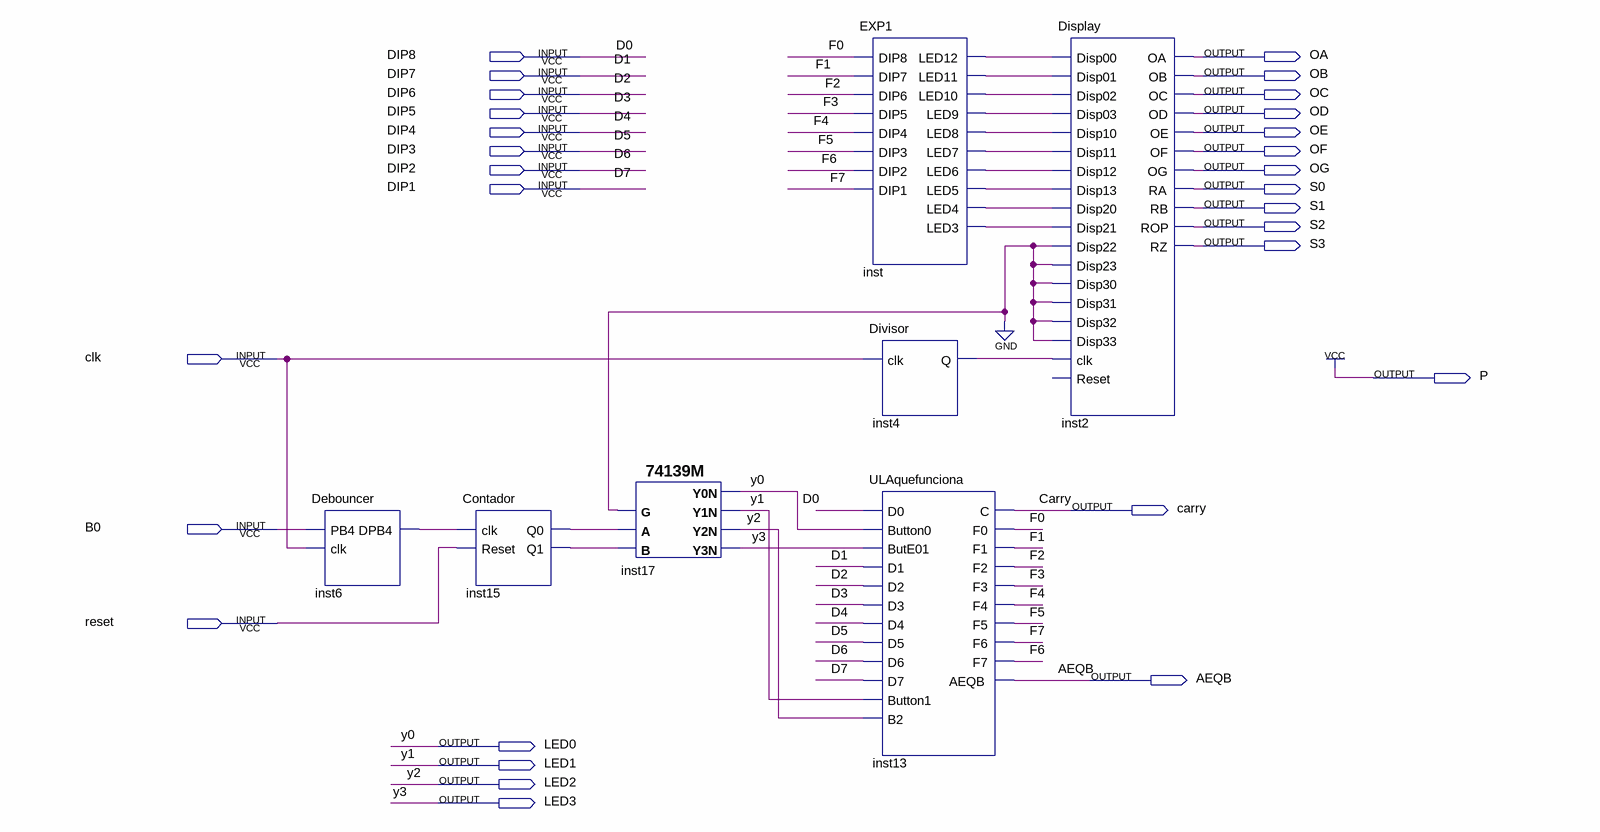
[diagram p0: schematic sheet]
// Quartus schematic PRINCIPAL.bdf as structural Verilog: 7 symbols, 29 pins
module PRINCIPAL (
  input  DIP8,
  input  DIP7,
  input  DIP6,
  input  DIP5,
  input  DIP4,
  input  DIP3,
  input  DIP2,
  input  DIP1,
  input  clk,
  input  B0,
  input  reset,
  output OA,
  output OB,
  output OC,
  output OD,
  output OE,
  output OF,
  output OG,
  output S0,
  output S1,
  output S2,
  output S3,
  output P,
  output carry,
  output AEQB,
  output LED0,
  output LED1,
  output LED2,
  output LED3
);

  wire F0, F1, F2, F3, F4, F5, F6, F7, inst4_q, inst6_dpb4, inst15_q0, inst15_q1, inst_led3, inst_led4,
       inst_led5, inst_led6, inst_led7, inst_led8, inst_led9, inst_led10, inst_led11, inst_led12;

  Debouncer inst6 (.PB4(B0), .clk(clk), .DPB4(inst6_dpb4));
  Contador inst15 (.clk(inst6_dpb4), .Reset(reset), .Q0(inst15_q0), .Q1(inst15_q1));
  \74139M  inst17 (.B(inst15_q1), .A(inst15_q0), .G(1'b0), .Y3N(LED3), .Y2N(LED2), .Y0N(LED0), .Y1N(LED1));
  EXP1 inst (
    .DIP8(F0), .DIP7(F1), .DIP6(F2), .DIP5(F3), .DIP4(F4), .DIP3(F5), .DIP2(F6), .DIP1(F7),
    .LED12(inst_led12), .LED11(inst_led11), .LED10(inst_led10), .LED9(inst_led9), .LED8(inst_led8),
    .LED7(inst_led7), .LED6(inst_led6), .LED5(inst_led5), .LED4(inst_led4), .LED3(inst_led3));
  Divisor inst4 (.clk(clk), .Q(inst4_q));
  ULAquefunciona inst13 (
    .D0(DIP8), .Button0(LED0), .ButE01(LED3), .D1(DIP7), .D2(DIP6), .D3(DIP5), .D4(DIP4), .D5(DIP3),
    .D6(DIP2), .D7(DIP1), .Button1(LED1), .B2(LED2), .C(carry), .F0(F0), .F1(F1), .F2(F2), .F3(F3), .F4(F4),
    .F5(F5), .F6(F7), .F7(F6), .AEQB(AEQB));
  Display inst2 (
    .Disp00(inst_led12), .Disp01(inst_led11), .Disp02(inst_led10), .Disp03(inst_led9), .Disp10(inst_led8),
    .Disp11(inst_led7), .Disp12(inst_led6), .Disp13(inst_led5), .Disp20(inst_led4), .Disp21(inst_led3),
    .Disp22(1'b0), .Disp23(1'b0), .Disp30(1'b0), .Disp31(1'b0), .Disp32(1'b0), .Disp33(1'b0), .clk(inst4_q),
    .OA(OA), .OB(OB), .OC(OC), .OD(OD), .OE(OE), .OF(OF), .OG(OG), .RA(S0), .RB(S1), .ROP(S2), .RZ(S3));  // open: Reset

  assign P = 1'b1;

  // Other names for the same wires on the sheet: D0 = DIP8; D1 = DIP7; D2 = DIP6; D3 = DIP5; D4 = DIP4; D5 = DIP3;
  //   D6 = DIP2; D7 = DIP1; y0 = LED0; y1 = LED1; y2 = LED2; y3 = LED3
endmodule
